# EAGLE design BRD1001-001-001-320 - Counting Registers (EAGLE 9.4.2)
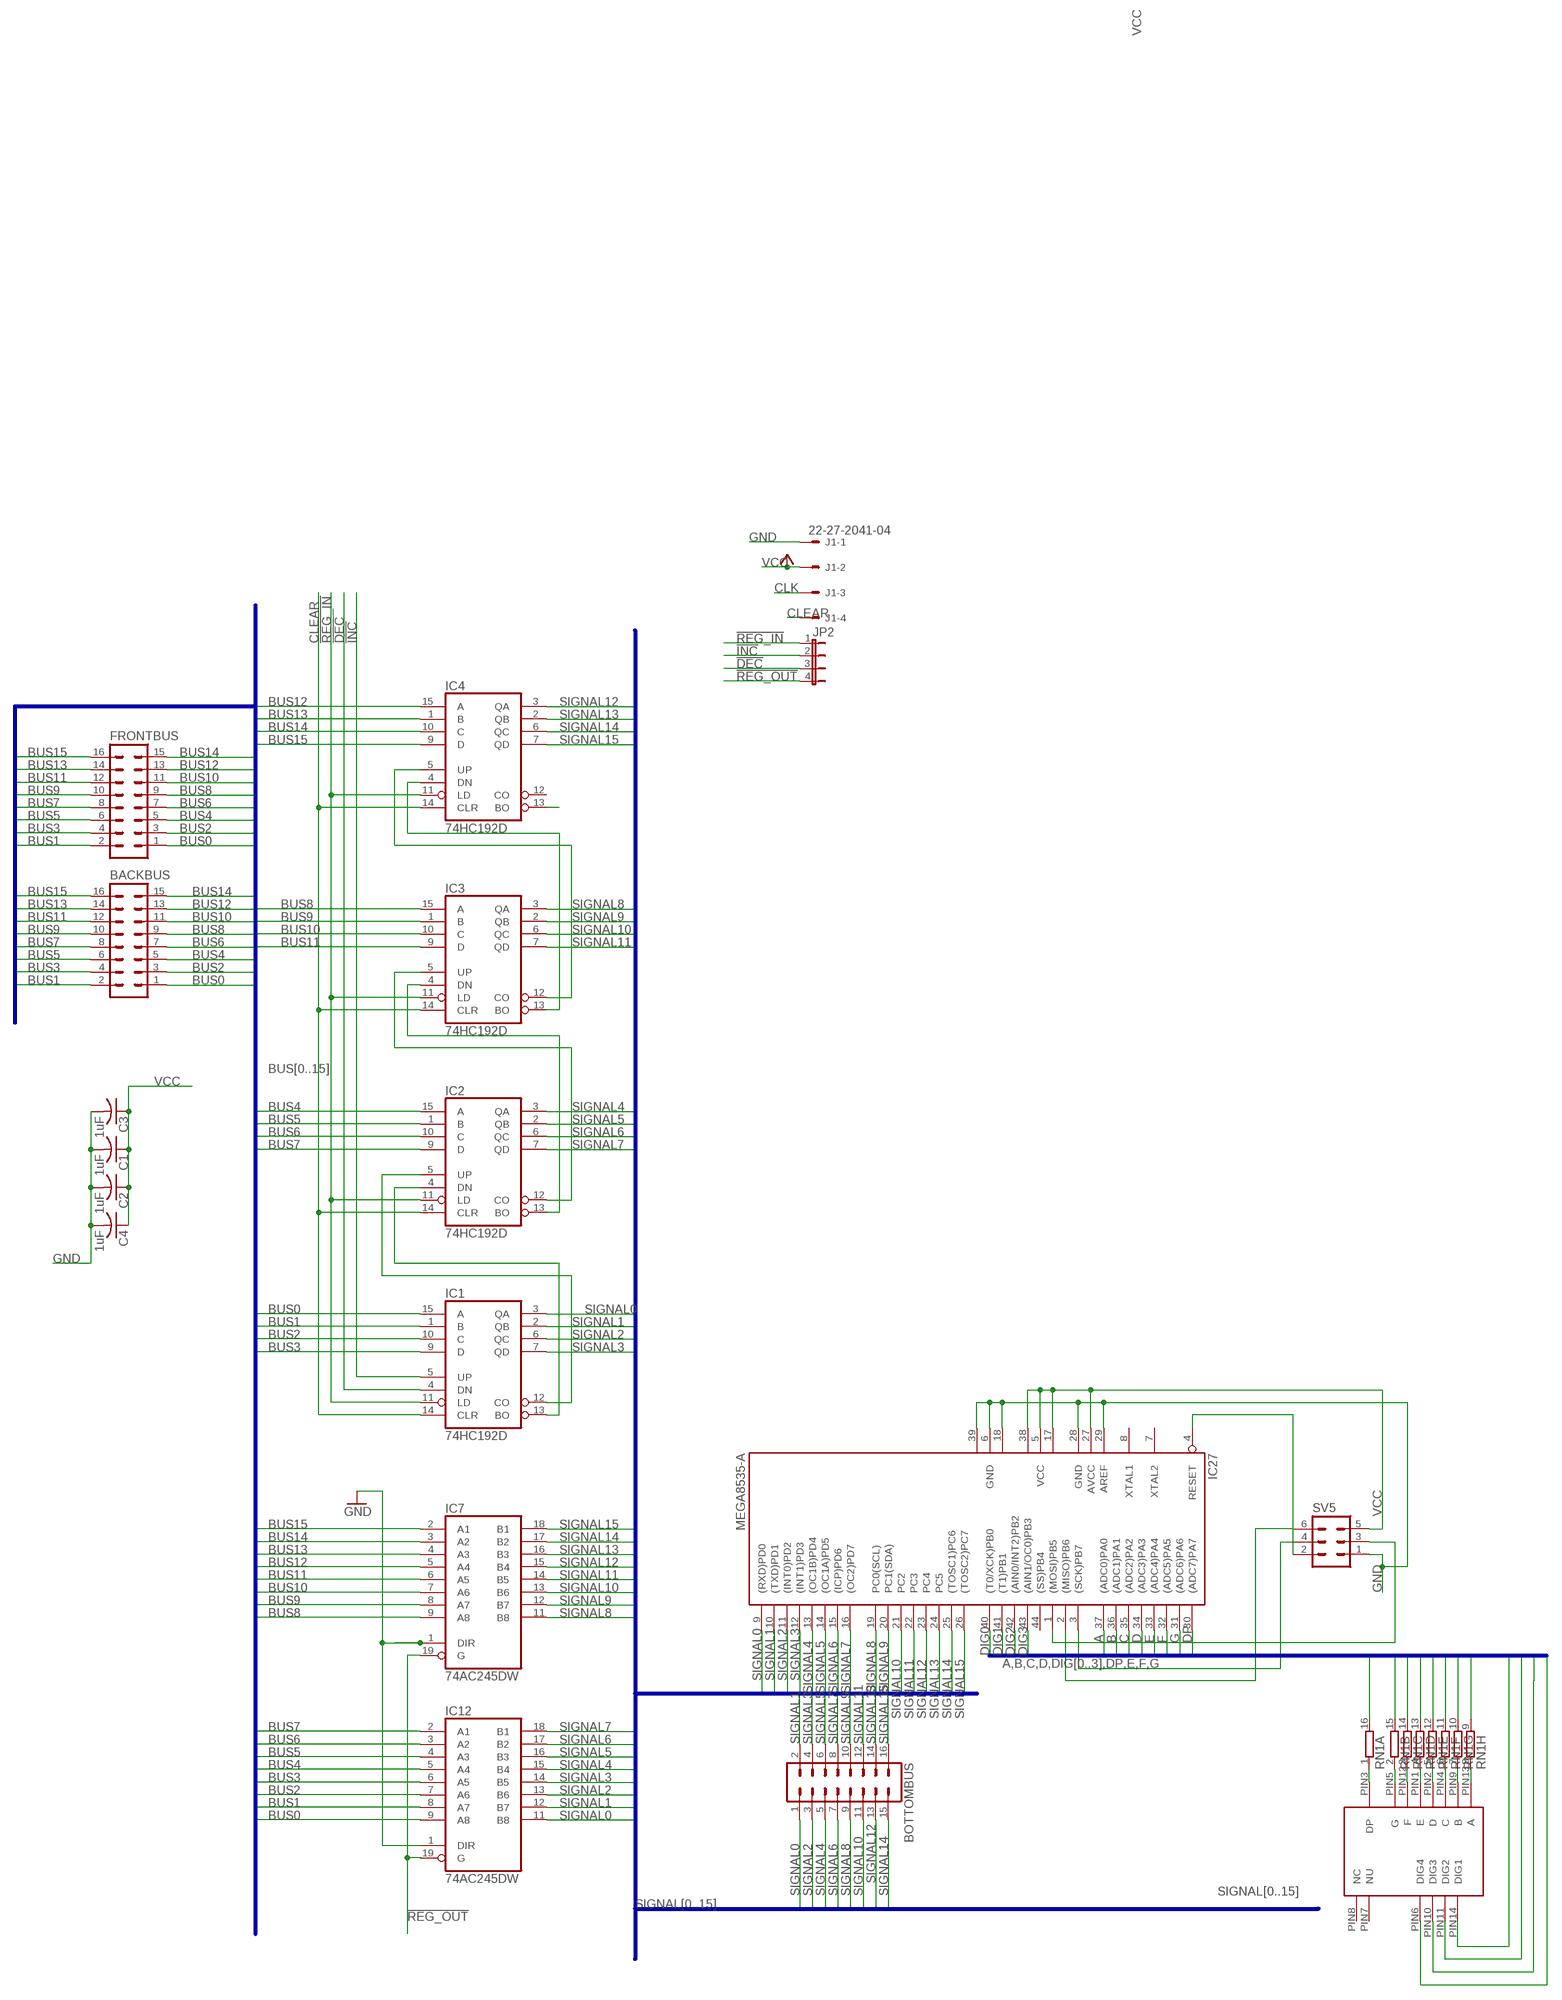
[diagram p0: schematic, sheet 1]

## Parts
BACKBUS  ML16  [ML16]
BOTTOMBUS  ML16  [ML16]
C1  1uF  C-USC1206  [C1206]
C2  1uF  C-USC1206  [C1206]
C3  1uF  C-USC1206  [C1206]
C4  1uF  C-USC1206  [C1206]
FRONTBUS  ML16  [ML16]
IC1  74HC192D  [SO16]
IC2  74HC192D  [SO16]
IC3  74HC192D  [SO16]
IC4  74HC192D  [SO16]
IC7  74AC245DW  [SO20W]
IC12  74AC245DW  [SO20W]
IC27  MEGA8535-A  [TQFP44]
J1  22-27-2041-04  [6410-04]
JP2  JP4E  [JP4]
RN1  8R-NSOMC  [SOMC16]
SV5  ML6  [ML6]
U$1  4-DIGIT-7-SEGMENT  [4-DIGIT-7-SEGMENT]

## Nets
!DEC: IC1.4(DN) JP2.3
!INC: IC1.5(UP) JP2.2
!REG_IN: IC1.11(LD) IC2.11(LD) IC3.11(LD) IC4.11(LD) JP2.1
!REG_OUT: IC7.19(G) IC12.19(G) JP2.4
A: IC27.37((ADC0)PA0) RN1.9
B: IC27.36((ADC1)PA1) RN1.10
BUS0: BACKBUS.1 FRONTBUS.1 IC1.15(A) IC12.9(A8)
BUS1: BACKBUS.2 FRONTBUS.2 IC1.1(B) IC12.8(A7)
BUS2: BACKBUS.3 FRONTBUS.3 IC1.10(C) IC12.7(A6)
BUS3: BACKBUS.4 FRONTBUS.4 IC1.9(D) IC12.6(A5)
BUS4: BACKBUS.5 FRONTBUS.5 IC2.15(A) IC12.5(A4)
BUS5: BACKBUS.6 FRONTBUS.6 IC2.1(B) IC12.4(A3)
BUS6: BACKBUS.7 FRONTBUS.7 IC2.10(C) IC12.3(A2)
BUS7: BACKBUS.8 FRONTBUS.8 IC2.9(D) IC12.2(A1)
BUS8: BACKBUS.9 FRONTBUS.9 IC3.15(A) IC7.9(A8)
BUS9: BACKBUS.10 FRONTBUS.10 IC3.1(B) IC7.8(A7)
BUS10: BACKBUS.11 FRONTBUS.11 IC3.10(C) IC7.7(A6)
BUS11: BACKBUS.12 FRONTBUS.12 IC3.9(D) IC7.6(A5)
BUS12: BACKBUS.13 FRONTBUS.13 IC4.15(A) IC7.5(A4)
BUS13: BACKBUS.14 FRONTBUS.14 IC4.1(B) IC7.4(A3)
BUS14: BACKBUS.15 FRONTBUS.15 IC4.10(C) IC7.3(A2)
BUS15: BACKBUS.16 FRONTBUS.16 IC4.9(D) IC7.2(A1)
C: IC27.35((ADC2)PA2) RN1.11
CLEAR: IC1.14(CLR) IC2.14(CLR) IC3.14(CLR) IC4.14(CLR) J1.4
CLK: J1.3
D: IC27.34((ADC3)PA3) RN1.12
DIG0: IC27.40((T0/XCK)PB0) U$1.PIN14(DIG1)
DIG1: IC27.41((T1)PB1) U$1.PIN11(DIG2)
DIG2: IC27.42((AIN0/INT2)PB2) U$1.PIN10(DIG3)
DIG3: IC27.43((AIN1/OC0)PB3) U$1.PIN6(DIG4)
DP: IC27.30((ADC7)PA7) RN1.16
E: IC27.33((ADC4)PA4) RN1.13
F: IC27.32((ADC5)PA5) RN1.14
G: IC27.31((ADC6)PA6) RN1.15
GND [power]: C1.2 C2.2 C3.2 C4.2 IC7.1(DIR) IC12.1(DIR) IC27.6(GND) IC27.18(GND1) IC27.28(GND) IC27.29(AREF) IC27.39(GND2) J1.1 SV5.1
N$1: IC4.13(BO)
N$2: IC1.12(CO) IC2.5(UP)
N$3: IC1.13(BO) IC2.4(DN)
N$4: IC2.12(CO) IC3.5(UP)
N$5: IC2.13(BO) IC3.4(DN)
N$6: IC3.12(CO) IC4.5(UP)
N$7: IC3.13(BO) IC4.4(DN)
N$18: IC27.1((MOSI)PB5) SV5.3
N$19: IC27.3((SCK)PB7) SV5.4
N$20: IC27.2((MISO)PB6) SV5.6
N$21: IC27.4(RESET) SV5.2
N$24: RN1.8 U$1.PIN13(A)
N$25: RN1.7 U$1.PIN9(B)
N$26: RN1.6 U$1.PIN4(C)
N$27: RN1.5 U$1.PIN2(D)
N$28: RN1.4 U$1.PIN1(E)
N$29: RN1.3 U$1.PIN12(F)
N$30: RN1.2 U$1.PIN5(G)
N$31: RN1.1 U$1.PIN3(DP)
SIGNAL0: BOTTOMBUS.1 IC1.3(QA) IC12.11(B8) IC27.9((RXD)PD0)
SIGNAL1: BOTTOMBUS.2 IC1.2(QB) IC12.12(B7) IC27.10((TXD)PD1)
SIGNAL2: BOTTOMBUS.3 IC1.6(QC) IC12.13(B6) IC27.11((INT0)PD2)
SIGNAL3: BOTTOMBUS.4 IC1.7(QD) IC12.14(B5) IC27.12((INT1)PD3)
SIGNAL4: BOTTOMBUS.5 IC2.3(QA) IC12.15(B4) IC27.13((OC1B)PD4)
SIGNAL5: BOTTOMBUS.6 IC2.2(QB) IC12.16(B3) IC27.14((OC1A)PD5)
SIGNAL6: BOTTOMBUS.7 IC2.6(QC) IC12.17(B2) IC27.15((ICP)PD6)
SIGNAL7: BOTTOMBUS.8 IC2.7(QD) IC12.18(B1) IC27.16((OC2)PD7)
SIGNAL8: BOTTOMBUS.9 IC3.3(QA) IC7.11(B8) IC27.19(PC0(SCL))
SIGNAL9: BOTTOMBUS.10 IC3.2(QB) IC7.12(B7) IC27.20(PC1(SDA))
SIGNAL10: BOTTOMBUS.11 IC3.6(QC) IC7.13(B6) IC27.21(PC2)
SIGNAL11: BOTTOMBUS.12 IC3.7(QD) IC7.14(B5) IC27.22(PC3)
SIGNAL12: BOTTOMBUS.13 IC4.3(QA) IC7.15(B4) IC27.23(PC4)
SIGNAL13: BOTTOMBUS.14 IC4.2(QB) IC7.16(B3) IC27.24(PC5)
SIGNAL14: BOTTOMBUS.15 IC4.6(QC) IC7.17(B2) IC27.25((TOSC1)PC6)
SIGNAL15: BOTTOMBUS.16 IC4.7(QD) IC7.18(B1) IC27.26((TOSC2)PC7)
VCC [power]: C1.1 C2.1 C3.1 C4.1 IC27.5(VCC) IC27.17(VCC1) IC27.27(AVCC) IC27.38(VCC2) J1.2 SV5.5
Unconnected: IC4.12(CO) IC27.7(XTAL2) IC27.8(XTAL1) IC27.44((SS)PB4) U$1.PIN7(NU) U$1.PIN8(NC)

## Buses
BUS[0..15]
SIGNAL[0..15]
A,B,C,D,DIG[0..3],DP,E,F,G

## Power pins joined to a net without a drawn wire
GND: IC1.8(GND) IC2.8(GND) IC3.8(GND) IC4.8(GND) IC7.10(GND) IC12.10(GND)
VCC: IC1.16(VCC) IC2.16(VCC) IC3.16(VCC) IC4.16(VCC) IC7.20(VCC) IC12.20(VCC)

## Library data of the parts
BACKBUS BOTTOMBUS FRONTBUS = con-harting-ml:ML16: HARTING; OC_FARNELL: unknown; OC_NEWARK: unknown
C1-C4 = rcl:C-US: CAPACITOR, American symbol; SPICEPREFIX: C
IC1-IC4 = 74xx-eu:74*192: Synchronous 4-bit UP/DOWN COUNTER
IC7 IC12 = 74xx-eu:74*245: Octal BUS TRANSCEIVER, 3-state
IC27 = atmel:MEGA8535: MICROCONTROLLER 8 Kbytes FLASH 512 bytes SRAM 512 bytes EEPROM USART 8-channel 10 bit ADC Source: avr.lbr; MPN: ATMEGA8535-16AU; OC_FARNELL: 1528437; OC_NEWARK: 01M6908
J1 = con-molex:22-?-04: CONNECTOR wire to board 2.54 mm (.1 inch) pitch header; MF: MOLEX; OC_FARNELL: unknown; OC_NEWARK: unknown
JP2 = jumper:JP4E: JUMPER
RN1 = resistor-dil:8R-N: DIL RESISTOR; OC_FARNELL: unknown; OC_NEWARK: unknown
SV5 = con-harting-ml:ML6: HARTING; OC_FARNELL: unknown; OC_NEWARK: unknown
U$1 = ADAFRUIT:4-DIGIT-7-SEGMENT

## Net classes
1 power: width 0.457 mm

## Board
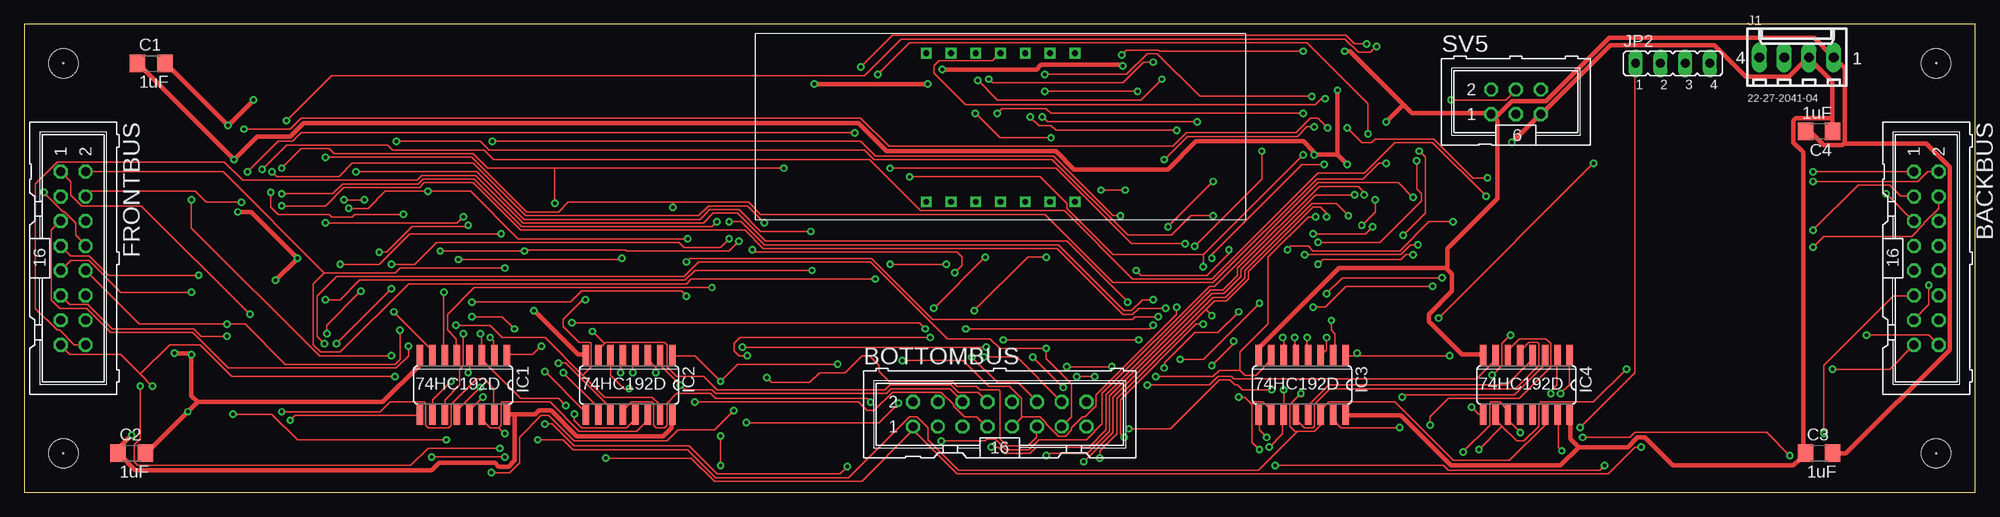
[diagram p1: board, top side]
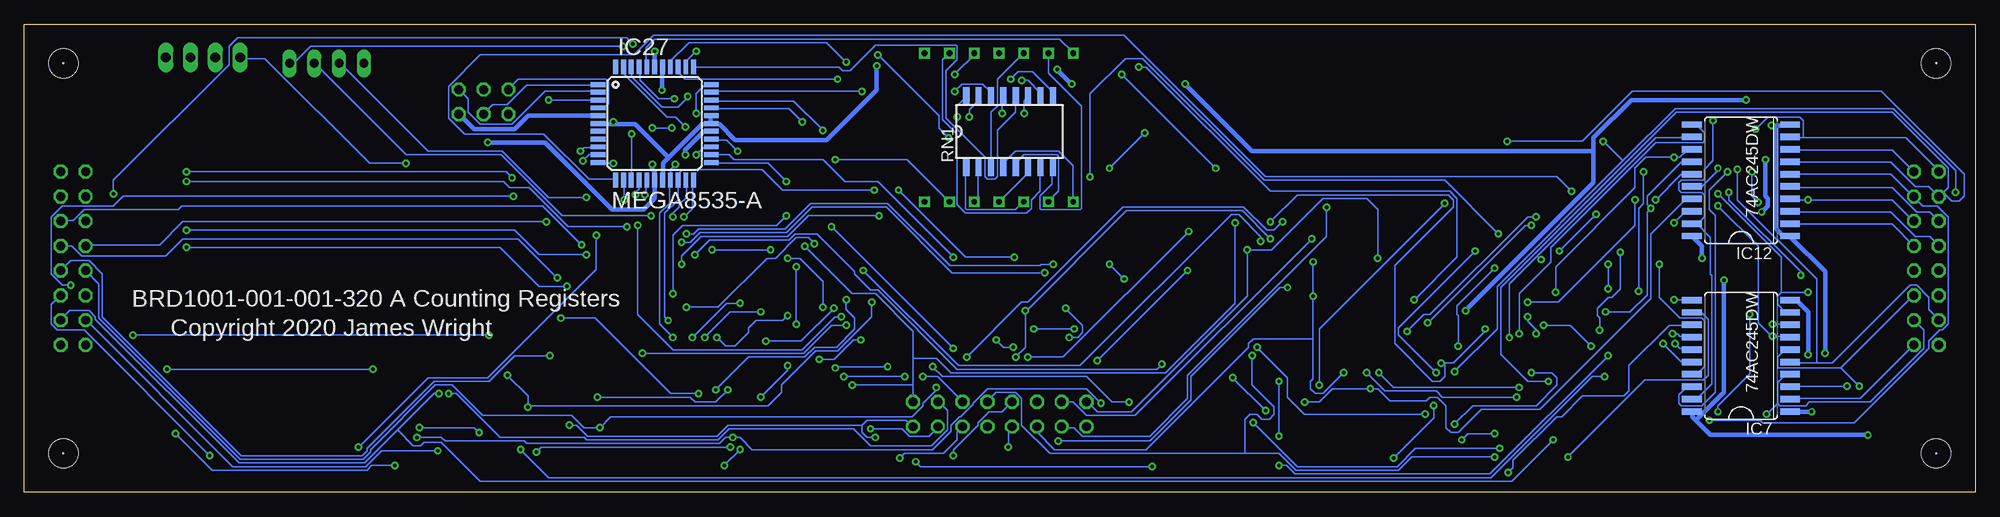
[diagram p2: board, bottom side, seen from below]

Size 200 x 48 mm. Coordinates in mm from the lower left corner, seen from the top.
Outline: 0,0 200,0 200,48 0,48 0,0
Copper layers (1*16): Top 0.035mm / dielectric 1.5mm / Bottom 0.035mm
Design rules "default *": minimum track width 6mil, minimum drill 0.35mm, track to track 6mil, track to pad 6mil, pad to pad 6mil, via to via 6mil, smd to smd 6mil, copper to edge 40mil, drill to drill 6mil, minimum pad ring 10mil, minimum via ring 8mil, stop-mask expansion 4mil, vias tented up to drill 0mil, thermal gap 10mil
Holes 0.12 mm at 4,4 196,44 4,44 196,4
Holes 3 mm at 4,44 4,4 196,4 196,44

### Footprints (pad centres in the part's own frame; a part is rotated, then mirrored left to right if it is on the bottom)
ML16 = drill 0.914 octagon: 1 -8.89,-1.27; 2 -8.89,1.27; 3 -6.35,-1.27; 4 -6.35,1.27; 5 -3.81,-1.27; 6 -3.81,1.27; 7 -1.27,-1.27; 8 -1.27,1.27; 9 1.27,-1.27; 10 1.27,1.27; 11 3.81,-1.27; 12 3.81,1.27; 13 6.35,-1.27; 14 6.35,1.27; 15 8.89,-1.27; 16 8.89,1.27
C1206 = smd 1.6 x 1.8: 1 -1.4,0; 2 1.4,0
SO16 = smd 0.66 x 2.032: 1 -4.445,-3.073; 2 -3.175,-3.073; 3 -1.905,-3.073; 4 -0.635,-3.073; 5 0.635,-3.073; 6 1.905,-3.073; 7 3.175,-3.073; 8 4.445,-3.073; 9 4.445,3.073; 10 3.175,3.073; 11 1.905,3.073; 12 0.635,3.073; 13 -0.635,3.073; 14 -1.905,3.073; 15 -3.175,3.073; 16 -4.445,3.073
SO20W = smd 0.66 x 2.032: 1 -5.715,-5.029; 2 -4.445,-5.029; 3 -3.175,-5.029; 4 -1.905,-5.029; 5 -0.635,-5.029; 6 0.635,-5.029; 7 1.905,-5.029; 8 3.175,-5.029; 9 4.445,-5.029; 10 5.715,-5.029; 11 5.715,5.029; 12 4.445,5.029; 13 3.175,5.029; 14 1.905,5.029; 15 0.635,5.029; 16 -0.635,5.029; 17 -1.905,5.029; 18 -3.175,5.029; 19 -4.445,5.029; 20 -5.715,5.029
TQFP44 = smd 1.5 x 0.5: 1 -5.8,4; 2 -5.8,3.2; 3 -5.8,2.4; 4 -5.8,1.6; 5 -5.8,0.8; 6 -5.8,0; 7 -5.8,-0.8; 8 -5.8,-1.6; 9 -5.8,-2.4; 10 -5.8,-3.2; 11 -5.8,-4; 23 5.8,-4; 24 5.8,-3.2; 25 5.8,-2.4; 26 5.8,-1.6; 27 5.8,-0.8; 28 5.8,0; 29 5.8,0.8; 30 5.8,1.6; 31 5.8,2.4; 32 5.8,3.2; 33 5.8,4 | smd 0.5 x 1.5: 12 -4,-5.8; 13 -3.2,-5.8; 14 -2.4,-5.8; 15 -1.6,-5.8; 16 -0.8,-5.8; 17 0,-5.8; 18 0.8,-5.8; 19 1.6,-5.8; 20 2.4,-5.8; 21 3.2,-5.8; 22 4,-5.8; 34 4,5.8; 35 3.2,5.8; 36 2.4,5.8; 37 1.6,5.8; 38 0.8,5.8; 39 0,5.8; 40 -0.8,5.8; 41 -1.6,5.8; 42 -2.4,5.8; 43 -3.2,5.8; 44 -4,5.8
6410-04 = drill 1.016 long: 1 3.81,0; 2 1.27,0; 3 -1.27,0; 4 -3.81,0
JP4 = drill 0.914 long: 1 -3.81,0; 2 -1.27,0; 3 1.27,0; 4 3.81,0
SOMC16 = smd 1.91 x 0.64: 1 -3.62,4.445; 2 -3.62,3.175; 3 -3.62,1.905; 4 -3.62,0.635; 5 -3.62,-0.635; 6 -3.62,-1.905; 7 -3.62,-3.175; 8 -3.62,-4.445; 9 3.62,-4.445; 10 3.62,-3.175; 11 3.62,-1.905; 12 3.62,-0.635; 13 3.62,0.635; 14 3.62,1.905; 15 3.62,3.175; 16 3.62,4.445
ML6 = drill 0.914 octagon: 1 -2.54,-1.27; 2 -2.54,1.27; 3 0,-1.27; 4 0,1.27; 5 2.54,-1.27; 6 2.54,1.27
4-DIGIT-7-SEGMENT = drill 0.6 square: PIN1 17.48,1.88; PIN2 20.02,1.88; PIN3 22.56,1.88; PIN4 25.1,1.88; PIN5 27.64,1.88; PIN6 30.18,1.88; PIN7 32.72,1.88; PIN8 32.72,17.12; PIN9 30.18,17.12; PIN10 27.64,17.12; PIN11 25.1,17.12; PIN12 22.56,17.12; PIN13 20.02,17.12; PIN14 17.48,17.12

### Placement (x,y rotation side)
BACKBUS  195,24 270 top
BOTTOMBUS  100,8 0 top
C1  13,44 0 top
C2  11,4 0 top
C3  184,4 0 top
C4  184,37 180 top
FRONTBUS  5,24 270 top
IC1  45,11 180 top
IC2  62,11 180 top
IC3  131,11 180 top
IC4  154,11 180 top
IC7  24,14 90 bottom
IC12  24,32 90 bottom
IC27  135.38,37.83 0 bottom
J1  181.7,44.61 0 top
JP2  169,44 0 top
RN1  99,37 90 bottom
SV5  152.92,40.05 0 top
U$1  74.98,27.92 0 top

### Tracks (layer width: path | path; a pad name or v marks a point on that pad's centre or on a via)
!DEC  (via drill 0.35)
  Top 0.152: v45.5,12.25 45.62,12.38 45.62,14 IC1.4 | v53.38,7 54.12,7 56.38,4.75 68.12,4.75 71,1.88 83.62,1.88 v84.38,2.62 | v108.62,3.12 111.62,6.12 111.62,9.75 121.88,20 123.12,20 125.12,22 125.12,22.75 132,29.62 134.5,29.62 v135.75,28.38
  Bottom 0.152: v45.5,12.25 43.38,12.25 42.88,11.75 42.88,11 45,8.88 51.5,8.88 v53.38,7 | v84.38,2.62 108.12,2.62 v108.62,3.12 | v135.75,28.38 144.88,28.38 151.12,34.62 160.88,34.62 170.25,44 JP2.3
!INC  (via drill 0.35)
  Top 0.152: v70.5,21 46.12,21 43.38,18.25 43.38,16.62 44.25,15.75 44.25,14.12 IC1.5 | v94,5.25 98.5,5.25 98.75,5.5 99.5,5.5 100.62,4.38 103,4.38 104,5.38 108.88,5.38 110.5,7 110.5,10.12 121.5,21.12 122,21.12 132.62,31.75 140.88,31.75 v142.38,30.25
  Bottom 0.152: v70.5,21 71.25,21 80.38,11.88 80.38,9.5 84.62,5.25 v94,5.25 | v142.38,30.25 146.25,30.25 151,35 158.62,35 167.62,44 JP2.2
!REG_IN  (via drill 0.35)
  Top 0.152: v45,16.25 45,13 44.62,12.62 44.62,11 43.12,9.5 43.12,8 IC1.11 | v45.88,18 49,18 v50.25,16.75 | v54.75,13.25 55.5,13.25 60,8.75 60,8 IC2.11 | v127.62,4.62 129,6 129,7.88 IC3.11 129.12,8 v129.12,10.5 | v147.5,4.12 150.25,6.88 150.25,9.12 150.38,9.25 151.25,9.25 152,8.5 152,8 IC4.11 152.12,7.88 152.12,7.38 v153.38,6.12 | v159.5,6.62 165.12,12.25 165.12,44 JP2.1 | v72.25,27.75 73.5,27.75 75.88,25.38 106,25.38 112.75,18.62 113.5,18.62 114.62,19.75 v115.75,19.75
  Bottom 0.152: v45,16.25 45,16.62 45.88,17.5 v45.88,18 | v50.25,16.75 50.25,16.5 53.5,13.25 54.38,13.25 | v127.62,4.62 147,4.62 v147.5,4.12 | v159.5,6.62 153.88,6.62 v153.38,6.12 | 54.38,13.25 54.38,11.88 54.88,11.38 55.62,11.38 59.5,15.25 59.5,23.25 53.5,29.25 53.5,30 54,30.5 69.5,30.5 v72.25,27.75 | v115.75,19.75 115.75,18.75 114.88,17.88 114.88,16.75 116.75,14.88 119,14.88 120,13.88 125.75,13.88 v129.12,10.5 | 54.38,13.25 v54.75,13.25
!REG_OUT  (via drill 0.35)
  Top 0.152: v138.62,45.75 138,45.12 136.75,45.12 135.38,46.5 89.88,46.5 86.12,42.75 31.5,42.75 v26.88,38.12
  Bottom 0.152: 28.5,27.5 27.12,26.12 27.12,22.38 27,22.25 27,11.12 28.5,9.62 29,9.62 IC7.19 | 28.5,27.5 29,27.5 IC12.19 28.5,27.5 | JP2.4 172.38,44 170.62,45.75 v138.62,45.75 | v26.88,38.12 26.88,34 27.75,33.12 27.75,32.12 27.88,32 30.12,32 30.38,31.75 30.38,31 30.12,30.75 28,30.75 27.75,30.5 27.75,28.25 28.5,27.5
A  (via drill 0.35)
  Top 0.152: v115.75,44.12 114.75,44.12 112.62,42 99.25,42 v98.88,42.38
  Bottom 0.152: v115.75,44.12 117.75,46.12 131.88,46.12 133.75,44.25 133.75,43.75 IC27.37 | v98.88,42.38 98.12,43.12 96.62,43.12 94.62,41.12 94.62,40.62 RN1.9
B  (via drill 0.35)
  Top 0.152: v116.62,42.38 114.5,40.25 99.75,40.25 v97.75,42.25
  Bottom 0.152: v116.62,42.38 132.25,42.38 132.88,43 132.88,43.62 IC27.36 | v97.75,42.25 97.12,42.25 95.88,41 95.88,40.62 RN1.10
BUS0  (via drill 0.35)
  Top 0.152: v26.38,8.25 36.5,8.25 37.5,9.25 41,9.25 41.12,9.12 41.12,6.88 41.38,6.62 43.5,6.62 43.75,6.88 43.75,9 46.38,11.62 47.12,11.62 48.12,10.62 48.12,8 IC1.15 | v23.12,18.25 12,29.38 5.88,29.38 4.75,30.5 4.75,31.88 3.75,32.88 FRONTBUS.1 | v183.38,32.88 193.62,32.88 BACKBUS.1 | v150,32.25 148.5,32.25 144.5,36.25 138.5,36.25 138.12,35.88 137.12,35.88 v135.62,37.38 | v133.62,37.38 132.62,38.38 131.88,38.38 130.38,36.88 119.12,36.88 117.75,35.5 88.62,35.5 85.75,38.38 28.38,38.38 27.25,37.25 v22.5,37.25
  Bottom 0.152: 17.62,36.38 7.12,36.38 3.75,33 FRONTBUS.1 | 17.62,36.38 18.88,36.38 IC12.9 | v26.38,8.25 26.38,8.88 23.12,12.12 v23.12,18.25 | v183.38,32.88 150.62,32.88 v150,32.25 | v133.62,37.38 v135.62,37.38 | v22.5,37.25 21.25,38.5 18,38.5 17.62,38.12 17.62,36.38
BUS1  (via drill 0.35)
  Top 0.152: v53,15 52.12,14.12 49.5,14.12 IC1.1 | v49.25,23 38.5,23 38,22.5 30.75,22.5 | 30.75,22.5 20.38,32.88 6.38,32.88 FRONTBUS.2 | v183.38,31.88 194.12,31.88 195.12,32.88 196.25,32.88 BACKBUS.2 | v138.25,27.25 137.5,26.5 v132.12,26.5 | v88.75,23.38 v94.5,23.38 | v87.25,21.88 68.38,21.88 67.88,21.38 39.38,21.38 32.38,14.38 30.38,14.38 29.62,15.12 29.62,21.38 30.75,22.5
  Bottom 0.152: IC12.8 18.88,35.12 8.5,35.12 6.38,33 FRONTBUS.2 | v53,15 53,18.12 53.12,18.25 53.12,19.12 v49.25,23 | v183.38,31.88 150.88,31.88 150.25,31.25 148.25,31.25 144.25,27.25 v138.25,27.25 | v132.12,26.5 131.38,26.5 130.88,27 122,27 119.38,29.62 111.5,29.62 105.12,23.25 95.88,23.25 95.75,23.38 v94.5,23.38 | v87.25,21.88 v88.75,23.38
BUS2  (via drill 0.35)
  Top 0.152: v43.75,11.38 41.88,9.5 41.88,8 IC1.10 | v183.38,26.88 188,31.5 191.25,31.5 192.38,30.38 193.62,30.38 BACKBUS.3 | v142.38,24.38 141.62,24.38 141.12,23.88 133.12,23.88 v132.62,23.38 | v112.38,28.38 111.62,28.38 105.5,34.5 87.25,34.5 85.75,36 v48,36
  Bottom 0.152: v43.75,11.38 45.88,11.38 48.62,14.12 48.62,21 30.62,39 8.5,39 2.75,33.25 2.75,31.25 3.25,30.75 | 3.25,30.75 3.62,30.38 FRONTBUS.3 | IC12.7 18.88,33.88 8.62,33.88 6.12,31.38 4.75,31.38 3.75,30.38 FRONTBUS.3 | v183.38,26.88 149.75,26.88 147.25,24.38 v142.38,24.38 | v132.62,23.38 132.62,24.25 130.62,26.25 121.75,26.25 119.62,28.38 v112.38,28.38 | v48,36 40.25,36 35.12,41.12 9.62,41.12 1.12,32.62 1.12,30.38 1.62,29.88 2.38,29.88 3.25,30.75 | 3.25,30.75 FRONTBUS.3
BUS3  (via drill 0.35)
  Top 0.152: v27.25,7.38 27.75,7.88 40.5,7.88 IC1.9 | v183.38,25.12 184.5,26.25 193.5,26.25 194.75,27.5 194.75,27.62 196.25,29.12 196.25,30.25 BACKBUS.4 | v144.38,21.12 135.5,21.12 133.38,19 v132.12,19 | v119,25.5 113.5,25.5 105.75,33.25 v88.75,33.25 | v85.12,36.88 28.38,36.88 27.5,36 26,36 v22.88,32.88 | v22.25,29.75 18.62,29.75 17.5,30.88 6.88,30.88 6.38,30.38 FRONTBUS.4
  Bottom 0.152: v27.25,7.38 22,7.38 21.75,7.12 12.38,7.12 4.75,14.75 4.75,15.5 3.62,16.62 3.38,16.62 2.75,17.25 2.75,28.25 3.88,29.38 5.38,29.38 6.25,30.25 FRONTBUS.4 6.38,30.38 8.62,32.62 18.88,32.62 IC12.6 | v183.38,25.12 151.25,25.12 147.25,21.12 v144.38,21.12 | v132.12,19 128.88,19 123.88,24 123,24 120.88,26.12 119.62,26.12 v119,25.5 | v85.12,36.88 v88.75,33.25 | v22.88,32.88 22.88,30.38 v22.25,29.75
BUS4  (via drill 0.35)
  Top 0.152: 57.25,12 53.38,15.88 49,15.88 47.75,17.12 v44.25,17.12 | 57.25,12 59.5,9.75 64.38,9.75 65.12,9 65.12,8 IC2.15 | v39.38,15 39.38,14 38.12,12.75 20.88,12.75 17.25,16.38 8.88,16.38 6.38,18.88 3.62,18.88 2.75,19.75 2.75,26.88 3.62,27.75 FRONTBUS.5 | v190.88,30.62 193.62,27.88 BACKBUS.5 | v137.62,46 136.38,46 135.5,46.88 89,46.88 v85.75,43.62 | v57.5,19.75 57.25,19.75 55.25,17.75 55.25,17 56.88,15.38 58,15.38 58.12,15.25 58.12,12.88 57.25,12
  Bottom 0.152: IC12.5 18.88,31.25 8.5,31.25 6,28.75 4.62,28.75 3.75,27.88 FRONTBUS.5 | v44.25,17.12 41.5,17.12 v39.38,15 | v190.88,30.62 190.88,32 179,43.88 179,45.75 178.12,46.62 138.25,46.62 v137.62,46 | v85.75,43.62 85,43.62 72.25,30.88 53.88,30.88 53.12,30.12 53.12,24.12 v57.5,19.75
BUS5  (via drill 0.35)
  Top 0.152: v71.38,2.75 v71.38,5.75 | v37.62,14 30.25,14 17.12,27.12 v17.12,30 | IC2.1 66.5,14 68.75,14 v71.38,11.38 73.12,13.12 v83.38,13.12 | v142.88,25.38 142.12,25.38 141.12,24.38 v131.25,24.38
  Bottom 0.152: IC12.4 18.88,30 v17.12,30 8.5,30 6.38,27.88 FRONTBUS.6 | v71.38,5.75 v71.38,11.38 | v71.38,2.75 70.62,2.75 69.75,1.88 49.75,1.88 v37.62,14 | v142.88,25.38 146.88,29.38 183.88,29.38 184.25,29 193.88,29 195,27.88 196.25,27.88 BACKBUS.6 | v131.25,24.38 129.75,25.88 121.62,25.88 121,26.5 118.75,26.5 114.88,22.62 114.88,22.38 113.25,20.75 112.5,20.75 104.38,12.62 83.88,12.62 v83.38,13.12
BUS6  (via drill 0.35)
  Top 0.152: v55.25,12.25 58.75,8.75 58.75,8 IC2.10 | v42.62,24.75 v51.25,24.75 51.38,24.88 61.62,24.88 61.75,24.75 72.25,24.75 v73.25,25.75 | v38.88,28.5 33.88,28.5 33.62,28.25 31.5,28.25 31.25,28.5 26,28.5 25.25,29.25 v25.25,30.75 | v17.88,22.25 8.62,22.25 6.62,24.25 4.75,24.25 FRONTBUS.7 | v146.5,27.75 144,27.75 141,24.75 132.12,24.75 131.62,25.25 129.88,25.25 v129.5,24.88 | v123.5,24.88 123.5,24.5 121.25,22.25 114.5,22.25 v114,22.75
  Bottom 0.152: v55.25,12.25 59.12,16.12 59.12,16.88 v51.25,24.75 | v38.88,28.5 v42.62,24.75 | v25.25,30.75 25.25,30 17.88,22.62 v17.88,22.25 | IC12.3 18.88,28.75 8.62,28.75 6.12,26.25 4.62,26.25 3.75,25.38 FRONTBUS.7 | v146.5,27.75 183.75,27.75 186.12,25.38 193.62,25.38 BACKBUS.7 | v123.5,24.88 v129.5,24.88 | v114,22.75 104.25,13 91.75,13 76.25,28.5 75.5,28.5 73.25,26.25 v73.25,25.75
BUS7  (via drill 0.35)
  Top 0.152: v53.38,12.38 57.5,8.25 57.5,8 IC2.9 | v2,30.75 4,28.75 4.12,28.75 5.25,27.62 5.25,26.38 6.25,25.38 FRONTBUS.8 | v145.38,22 135.12,22 v133.5,20.38 | v121.88,28.38 119.62,28.38 117.62,26.38 113.12,26.38 105.38,34.12 87.12,34.12 86.12,35.12 47.62,35.12 46.75,36 v38.12,36
  Bottom 0.152: FRONTBUS.8 8.5,27.5 18.88,27.5 IC12.2 | v53.38,12.38 49,16.75 49,21.12 36.12,34 | 36.12,34 30.75,39.38 8.38,39.38 2,33 v2,30.75 | v145.38,22 149.38,26 183.75,26 185.5,24.25 194.12,24.25 195.12,25.25 196.25,25.25 BACKBUS.8 | v133.5,20.38 133.5,26.38 132.5,27.38 122.88,27.38 v121.88,28.38 | 36.12,34 v38.12,36
BUS8  (via drill 0.35)
  Top 0.152: v17.12,20.5 9.88,20.5 6.62,23.75 4.75,23.75 FRONTBUS.9 | v141,6.62 135,6.62 134.25,7.38 134.25,7.88 IC3.15 | v26.38,30.62 31.62,30.62 32.62,31.62 40.38,31.62 40.88,32.12 46.12,32.12 51,27.25 70.5,27.25 v71,27.75 | v106.5,10.75 v103.38,13.88
  Bottom 0.152: 19.88,20.5 20.25,20.12 20.25,19.25 19.5,18.5 19,18.5 IC7.9 | v17.12,20.5 19.88,20.5 | BACKBUS.9 192.38,21.38 192.38,17.88 177.88,3.38 165.25,3.38 164.5,4.12 164.5,4.38 157.88,11 156.12,11 153,7.88 143.88,7.88 142.62,6.62 v141,6.62 139.88,7.75 109,7.75 107.88,8.88 107.88,9.12 106.5,10.5 v106.5,10.75 | 19.88,20.5 19.88,24.12 v26.38,30.62 | v71,27.75 71.88,26.88 72.62,26.88 75,29.25 87.38,29.25 97.12,19.5 97.75,19.5 v103.38,13.88
BUS9  (via drill 0.35)
  Top 0.152: FRONTBUS.10 11.75,17.25 v20.75,17.25 22.62,17.25 26.75,13.12 38,13.12 38.5,13.62 v38.5,16.62 | v146.12,14 136.62,14 | 136.62,14 135.5,14 IC3.1 | v36.38,24.62 37.12,24.62 39.75,27.25 45.38,27.25 v45.5,27.38 | v56.12,17.38 91.75,17.38 v92.38,16.75 | v96.5,16.75 115.38,16.75 v115.75,17.12 | 136.62,14 v136.62,14.25
  Bottom 0.152: v20.75,17.25 19,17.25 IC7.8 | v146.12,14 149.75,14 152.38,11.38 158,11.38 164.88,4.5 164.88,4.25 165.38,3.75 177.75,3.75 192,18 192,22.38 193.38,23.75 195.25,23.75 BACKBUS.10 | v38.5,16.62 38.5,17.88 38.75,18.12 38.75,18.88 37.62,20 37.25,20 36.38,20.88 v36.38,24.62 | v45.5,27.38 46.12,27.38 v56.12,17.38 | v96.5,16.75 v92.38,16.75 | v115.75,17.12 117.25,17.12 120.12,14.25 v136.62,14.25
BUS10  (via drill 0.35)
  Top 0.152: v20.75,16 18.12,16 17.38,16.75 9,16.75 6.5,19.25 4.62,19.25 3.75,20.12 FRONTBUS.11 | 125.88,9 126.12,9.25 127,9.25 127.75,8.5 127.75,8 IC3.10 | 125.88,9 125.88,5.12 v126.62,4.38 | v128.25,2.75 145.5,2.75 146,2.25 161.5,2.25 v162,2.75 | v184.5,6 184.5,13 191.62,20.12 193.62,20.12 BACKBUS.11 | v26.38,29.38 30.88,29.38 32.75,31.25 40.5,31.25 41,31.75 46,31.75 50.88,26.88 73.88,26.88 75.75,25 105.88,25 112.62,18.25 113.62,18.25 114.25,18.88 v117,18.88 | v124,15.5 124,15.25 v121.75,13 | v124.5,9.75 125.12,9.75 125.88,9
  Bottom 0.152: IC7.7 19,16 v20.75,16 21,16.25 21.12,16.25 22.25,17.38 22.25,25.25 v26.38,29.38 | v128.25,2.75 v126.62,4.38 | v162,2.75 164.38,2.75 164.88,2.25 180.75,2.25 v184.5,6 | v117,18.88 120.38,15.5 v124,15.5 | v121.75,13 121.75,12.5 v124.5,9.75
BUS11  (via drill 0.35)
  Top 0.152: v127.38,5.62 126.62,6.38 126.62,7.88 IC3.9 | v159.75,5.62 164.62,5.62 165.12,6.12 178.62,6.12 v181,3.75 | v11.88,10.88 11.88,5.5 11.25,4.88 11.25,3.12 11.62,2.75 39.62,2.75 41.38,4.5 v48.75,4.5 | v74,7.12 87.62,7.12 v89.62,9.12
  Bottom 0.152: 13.75,12.75 20.12,12.75 20.25,12.88 20.25,13.88 19.5,14.62 19,14.62 IC7.6 | 13.75,12.75 6.38,20.12 FRONTBUS.12 | v159.75,5.62 157.25,5.62 156.88,5.25 148.75,5.25 148.5,5 128.75,5 128.12,5.62 v127.38,5.62 126.62,5.62 125.38,4.38 106.88,4.38 105,6.25 105,6.88 104.12,7.75 104,7.75 102.75,9 102.75,9.12 101.25,10.62 91.12,10.62 v89.62,9.12 | v181,3.75 193.88,16.62 196.62,16.62 197.25,17.25 197.25,19.25 196.38,20.12 BACKBUS.12 | v11.88,10.88 13.75,12.75 | v48.75,4.5 57.38,4.5 59.25,2.62 69.5,2.62 v74,7.12
BUS12  (via drill 0.35)
  Top 0.152: v157.62,4.25 157.25,4.62 157.25,7.88 IC4.15 | v24.38,33.12 26.88,35.62 37.25,35.62 37.75,35.12 47.12,35.12 48.12,34.12 86.62,34.12 91.88,28.88 106.62,28.88 113.62,21.88 121.75,21.88 132.62,32.75 137.38,32.75 140.5,35.88 144.38,35.88 v149.88,30.38 | v195.25,21.25 195.25,19.25 193.75,17.75 BACKBUS.13
  Bottom 0.152: 16.25,13.25 14.62,13.25 6.62,21.25 6,21.25 4.75,20 4.75,18.75 3.75,17.75 FRONTBUS.13 | 16.25,13.25 18.88,13.25 IC7.5 | v157.62,4.25 163.38,4.25 165,2.62 178.62,2.62 193.62,17.62 BACKBUS.13 | 16.25,13.25 16.25,21.88 24.38,30 v24.38,33.12 | v149.88,30.38 189.88,30.38 190.88,29.38 196.12,29.38 197.25,28.25 197.25,22.38 196.12,21.25 v195.25,21.25
BUS13  (via drill 0.35)
  Top 0.152: v157.5,10.12 158.38,11 158.38,14 IC4.1 | v21.38,8 25.38,8 28,5.38 v43.25,5.38
  Bottom 0.152: 20.25,9.12 20.25,11.25 19.5,12 19,12 IC7.4 | 20.25,9.12 20,8.88 17.38,8.88 17,9.25 10.75,9.25 5.25,14.75 5.25,16.62 6.25,17.62 FRONTBUS.14 | v157.5,10.12 158,10.12 161.75,6.38 | 161.75,6.38 165.12,3 178,3 192.75,17.75 192.75,18 193.38,18.62 195.38,18.62 196.25,17.75 BACKBUS.14 | v21.38,8 20.25,9.12 | v43.25,5.38 47.5,1.12 153.25,1.12 157.25,5.12 159,5.12 159.38,4.75 160.12,4.75 161.75,6.38
BUS14  (via drill 0.35)
  Top 0.152: 11.88,12.12 9.88,14.12 4.62,14.12 3.75,15 FRONTBUS.15 | 11.88,12.12 v13.12,10.88 | 151.5,6.75 153,5.25 153.75,5.25 155.25,6.75 155.25,9 155.5,9.25 160.88,9.25 v164.25,12.62 | 151.5,6.75 150.88,7.38 150.88,7.88 IC4.10 | v185.38,12.62 191.25,12.62 193.62,15 BACKBUS.15 | 11.88,12.12 14.88,15.12 18,15.12 21.25,11.88 v38,11.88 | 151.5,6.75 v149.12,4.38
  Bottom 0.152: v13.12,10.88 18.88,10.88 IC7.3 | v185.38,12.62 v164.25,12.62 | v38,11.88 39.25,11.88 49.62,1.5 146.25,1.5 v149.12,4.38
BUS15  (via drill 0.35)
  Top 0.152: v148.38,8.75 149.12,8 149.5,8 IC4.9 | v150.5,12 151.5,13 151.5,15.25 v152.38,16.12 | v188.88,16.12 195.25,16.12 196.25,15.12 BACKBUS.16 | v113.12,19.5 106.88,25.75 76,25.75 73.12,28.62 70.62,28.62 69.62,27.62 51.12,27.62 46.25,32.5 40.75,32.5 40.25,32 22.38,32 20.5,33.88 3.38,33.88 1.12,31.62 1.12,18.88 3.38,16.62 3.62,16.62 5.12,15.12 6.25,15.12 FRONTBUS.16
  Bottom 0.152: IC7.2 18.88,9.62 11.75,9.62 6.38,15 FRONTBUS.16 | 148.38,8.88 148.38,9.88 v150.5,12 | v188.88,16.12 v152.38,16.12 | v113.12,19.5 113.12,18 116.62,14.5 118.88,14.5 122.38,11 122.38,10.25 123.75,8.88 148.38,8.88 | 148.38,8.88 v148.38,8.75
C  (via drill 0.35)
  Top 0.152: v131.12,45.25 116.38,45.25 116.25,45.38 113,45.38 v112.5,44.88 | v105.25,36.38 100,36.38 v97.5,38.88
  Bottom 0.152: v131.12,45.25 132.12,44.25 132.12,43.75 IC27.35 | v112.5,44.88 106.25,38.62 106.25,37.38 v105.25,36.38 | v97.5,38.88 97.5,40.12 97.12,40.5 RN1.11
CLEAR  (via drill 0.35)
  Top 0.152: 48.62,6.62 47.75,6.62 47,7.38 47,7.88 IC1.14 | 48.62,6.62 48.88,6.88 48.88,9.12 49,9.25 53.88,9.25 56.88,6.25 62.75,6.25 63.88,7.38 63.88,7.88 IC2.14 | IC4.14 155.88,7.88 155.88,6.88 152.25,3.25 146.5,3.25 140.5,9.25 133.75,9.25 133,8.5 133,8 IC3.14 132.88,7.88 132.88,6.88 132.25,6.25 130.5,6.25 | v145,17.88 v160.88,33.75 | v130.88,10.12 129.75,9 129.75,6.75 130.25,6.25 130.5,6.25 | v49.25,6 48.62,6.62 | v52.62,5.38 55.25,5.38 56.25,4.38 68,4.38 70.88,1.5 84.5,1.5 90.75,7.75 91.5,7.75 92.62,6.62 92.62,5.38 95.75,2.25 126.5,2.25 130.5,6.25
  Bottom 0.152: v160.88,33.75 164.62,33.75 175.38,44.5 177.88,44.5 J1.4 | v145,17.88 141.5,17.88 133.75,10.12 v130.88,10.12 | v49.25,6 52,6 v52.62,5.38
D
  Bottom 0.152: IC27.34 116.5,43.62 116.12,43.25 115.38,43.25 112.75,45.88 104.5,45.88 104.38,45.75 104.38,44.38 105.5,43.25 105.5,38.38 101.5,34.38 101.5,32.38 101.25,32.12 100.5,32.12 100.25,32.38 100.25,37.12 98.38,39 98.38,40.5 RN1.12
DIG0
  Bottom 0.152: IC27.40 136.25,43.75 136.25,45.62 135.38,46.5 93.88,46.5 92.5,45.12 U$1.PIN14
DIG1  (via drill 0.35)
  Top 0.152: v133.38,40.38 133,40.38 132.38,39.75 96.5,39.75 93.25,43 93.25,43.75 93.75,44.25 99.25,44.25 100,45 U$1.PIN11
  Bottom 0.152: v133.38,40.38 135,40.38 136.88,42.25 136.88,43.62 IC27.41
DIG2  (via drill 0.35)
  Top 0.152: v132,40.62 120.5,40.62 116.12,45 115.12,45 113,42.88 v104.62,42.88
  Bottom 0.152: v132,40.62 132,40.5 133,39.5 134.62,39.5 137.75,42.62 137.75,43.62 IC27.42 | v104.62,42.88 102.5,45 U$1.PIN10
DIG3  (via drill 0.35)
  Top 0.152: v132.25,37.5 131.5,37.5 130.5,36.5 119.25,36.5 v116.88,34.12
  Bottom 0.152: v132.25,37.5 133.25,38.5 134.12,38.5 138.5,42.88 138.5,43.62 IC27.43 | v116.88,34.12 109.5,34.12 105.25,29.88 U$1.PIN6
DP  (via drill 0.35)
  Top 0.152: v120.25,38 104.88,38 v104.38,38.5
  Bottom 0.152: v120.25,38 121.62,39.38 129.5,39.38 IC27.30 | v104.38,38.5 104.38,39.62 103.5,40.5 RN1.16
E  (via drill 0.35)
  Top 0.152: v131.12,38.88 105.25,38.88 104.75,39.38 100.25,39.38 v99.75,38.88
  Bottom 0.152: v131.12,38.88 131.12,40.88 130.25,41.75 129.62,41.75 IC27.33 | v99.75,38.88 99.75,40.5 RN1.13
F  (via drill 0.35)
  Top 0.152: v104.62,41.12 v114.12,41.12
  Bottom 0.152: v114.12,41.12 129.5,41.12 IC27.32 | v104.62,41.12 103.88,41.88 101.75,41.88 101,41.12 101,40.62 RN1.14
G  (via drill 0.35)
  Top 0.152: v118.12,37.12 105.75,37.12 105.25,37.62 104,37.62 v103.12,38.5
  Bottom 0.152: v118.12,37.12 121.12,40.12 129.5,40.12 IC27.31 | v103.12,38.5 103.12,39.25 102.25,40.12 102.25,40.5 RN1.15
GND  (via drill 0.35)
  Top 0.457: C2.2 12.5,4 v16.75,8.25 17.75,9.25 | 17.75,9.25 36.75,9.25 40.5,13 40.5,14 IC1.8 | 17.75,9.25 17.12,9.88 v17.12,14.12 17,14.25 v15.38,14.25 | C1.2 14.5,44 v20.88,37.62 v23.5,40.25 | v52.25,18.62 56.75,14.12 57.5,14.12 IC2.8 | 145.75,23 134.75,23 126.62,14.88 126.62,14.12 IC3.8 | 145.75,23 146.38,22.38 146.38,20.62 144,18.25 144,17.5 147.38,14.12 149.5,14.12 IC4.8 | v135.38,45.25 135.88,45.25 141.38,39.75 | 141.38,39.75 142.25,38.88 150.38,38.88 SV5.1 | 141.38,39.75 v139.62,38 | 145.75,23 145.88,23.12 145.88,25 151,30.12 151,38.12 150.5,38.62 SV5.1 | C4.2 183.12,37 184.5,35.62 186.38,35.62 186.62,35.88 | 186.62,35.88 186.62,43.5 185.62,44.5 J1.1 185.38,44.75 183.5,46.62 162.5,46.62 156,40.12 152.5,40.12 150.88,38.5 SV5.1 | C3.2 186.75,4 197.38,14.62 197.38,33.38 195,35.75 186.75,35.75 186.62,35.88 | v92.62,41.88 v81,41.88 | v94.12,43.38 103.75,43.38 104.25,43.88 112.5,43.88 v112.62,43.75
  Bottom 0.457: v16.75,8.25 18.88,8.25 IC7.1 | v17.12,14.12 17.12,18.5 18.25,19.62 18.88,19.62 IC7.10 | 20.38,37.62 19,37.62 IC12.10 | 20.38,37.62 v20.88,37.62 | v52.25,18.62 39.12,31.75 39.12,35 | 39.12,35 39.12,36.38 35.25,40.25 v23.5,40.25 | 20.38,37.62 20.38,27 19.75,26.38 19,26.38 IC12.1 18.88,26.12 15.38,22.62 v15.38,14.25 | IC27.28 129.62,37.88 129.62,38.62 IC27.29 | 133.94,34.31 130.5,37.75 129.75,37.75 IC27.28 | 133.94,34.31 134.5,33.75 134.5,32.12 IC27.18 | 139.62,37.75 137.38,37.75 133.94,34.31 | 139.62,37.75 141.12,37.75 IC27.6 | v135.38,45.25 135.38,43.75 IC27.39 | v139.62,38 139.62,37.75 | 39.12,35 74.12,35 v81,41.88 | v94.12,43.38 v92.62,41.88 | v112.62,43.75 112.62,41.25 117.75,36.12 127.12,36.12 128.75,37.75 129.38,37.75 IC27.28
N$2  (via drill 0.35)
  Top 0.152: v46.75,10.75 44.38,8.38 44.38,8 IC1.12 | v61.12,12.25 61.12,13.88 61.25,14 IC2.5
  Bottom 0.152: v46.75,10.75 59.62,10.75 v61.12,12.25
N$3  (via drill 0.35)
  Top 0.152: v47,9.75 45.75,8.5 45.75,8 IC1.13 | v62.38,12.25 62.38,13.75 62.62,14 IC2.4
  Bottom 0.152: v47,9.75 54.62,9.75 55.25,10.38 60.5,10.38 v62.38,12.25
N$4  (via drill 0.35)
  Top 0.152: v86.75,9.25 86.38,9.62 70.88,9.62 70.38,10.12 66.88,10.12 65.88,9.12 65.88,6.88 65.62,6.62 64.75,6.62 64.5,6.88 64.5,9.12 64.38,9.25 62.25,9.25 61.38,8.38 61.38,8 IC2.12 | v111.5,12.88 v106.88,12.88 | v116.88,12.75 116.88,13.25 120,16.38 122.38,16.38 v124.5,18.5 | v130.25,15.88 130.25,14.12 IC3.5
  Bottom 0.152: v86.75,9.25 88.5,9.25 91.12,11.88 105.88,11.88 v106.88,12.88 | v111.5,12.88 116.75,12.88 v116.88,12.75 | v124.5,18.5 127.62,18.5 v130.25,15.88
N$5  (via drill 0.35)
  Top 0.152: v56.38,8 56.38,7.38 57.12,6.62 61.75,6.62 62.62,7.5 62.62,7.88 IC2.13 | v98.62,14.88 v73.62,14.88 | v114.25,15.62 v100.38,15.62 | v118.5,13.62 120.88,13.62 v126.62,19.38 | v131.5,15.88 131.5,14.25 131.62,14.12 IC3.4
  Bottom 0.152: v56.38,8 68.75,8 70.5,9.75 70.5,11.75 v73.62,14.88 | v98.62,14.88 99.62,14.88 v100.38,15.62 | v114.25,15.62 115,15.62 117,13.62 v118.5,13.62 | v126.62,19.38 128,19.38 v131.5,15.88
N$6
  Top 0.152: IC3.12 130.38,7.88 130.38,7.5 131.25,6.62 132.12,6.62 132.25,6.75 132.25,9 133.88,10.62 152.88,10.62 155.25,13 155.25,15.25 155.12,15.38 154.25,15.38 153.38,14.5 153.38,14.12 IC4.5
N$7
  Top 0.152: IC3.13 131.75,8 131.75,9 133.75,11 152,11 154.62,13.62 154.62,14 IC4.4
N$18
  Bottom 0.152: IC27.1 141.25,41.75 148.5,41.75 150.5,39.75 152,39.75 152.88,38.88 SV5.3
N$19  (via drill 0.35)
  Top 0.152: v146.25,40.25 151.88,40.25 152.88,41.25 SV5.4
  Bottom 0.152: v146.25,40.25 141.25,40.25 IC27.3
N$20
  Bottom 0.152: IC27.2 141.25,41.12 146.62,41.12 150,37.75 153.25,37.75 154.5,39 154.5,40.38 155.38,41.25 SV5.6
N$21
  Bottom 0.152: IC27.4 141.12,39.5 140.5,39.5 140.12,39.88 140.12,42.12 140.38,42.38 149.38,42.38 150.38,41.38 SV5.2
N$24
  Bottom 0.152: U$1.PIN13 95,43 91.62,39.62 91.62,29.12 91.75,29 95.75,29 95.88,29.12 95.88,30.38 94.62,31.62 94.62,33.38 RN1.8
N$25
  Bottom 0.152: RN1.7 95.88,33.38 95.88,30.88 96.75,30 96.75,29.12 97.25,28.62 103.5,28.62 104.38,29.5 104.38,36.75 105.88,38.25 105.88,44.38 105.25,45 U$1.PIN9
N$26
  Bottom 0.152: RN1.6 97.12,33.38 97.12,32.75 100,29.88 U$1.PIN4
N$27
  Bottom 0.152: RN1.5 98.25,33.5 98.25,33.88 97.5,34.62 94.12,34.62 94,34.5 94,30.88 95,29.88 U$1.PIN2
N$28
  Bottom 0.152: RN1.4 99.62,33.5 99.62,33.75 98.38,35 94,35 92.5,33.5 92.5,29.88 U$1.PIN1
N$29
  Bottom 0.152: RN1.3 100.88,33.5 100.88,39 100.25,39.62 100.25,42.38 97.62,45 U$1.PIN12
N$30
  Bottom 0.152: RN1.2 102.25,33.38 102.25,30.12 102.5,29.88 U$1.PIN5
N$31
  Bottom 0.152: RN1.1 103.5,33.38 103.5,29.12 103.38,29 98.38,29 97.62,29.75 U$1.PIN3
SIGNAL0  (via drill 0.35)
  Top 0.152: v46.75,16.25 46.88,16.12 46.88,14.12 IC1.3 47,14 47,13.5 50.88,9.62 54.75,9.62 v55.5,8.88 | v143,35 143.62,34.38 143.62,28.62 v141.38,26.38 | v165.75,4.62 165.12,4.62 162.38,1.88 95.62,1.88 91.12,6.38 | 91.12,6.38 91.12,6.62 BOTTOMBUS.1 91.12,6.38 | v59.62,3.5 68.38,3.5 70.75,1.12 85.88,1.12 91.12,6.38
  Bottom 0.152: v46.75,16.25 46.75,20.38 43.5,23.62 43.5,25.12 32.75,35.88 27.88,35.88 27.75,36 27.75,36.88 28.5,37.62 29,37.62 IC12.11 | v143,35 142.62,35.38 141.25,35.38 IC27.9 | v141.38,26.38 141.38,22.88 152.5,11.75 158.62,11.75 v165.75,4.62 | v55.5,8.88 55.5,7.62 v59.62,3.5
SIGNAL1  (via drill 0.35)
  Top 0.152: v47.75,15.88 48.12,15.5 48.12,14.12 IC1.2 | v142.75,34 142.75,31.12 143.25,30.62 143.25,29.88 139,25.62 v132.62,25.62 | v95.38,22.5 96.12,23.25 96.12,24.12 95.62,24.62 74.88,24.62 v74.62,24.88 | v44.5,23.88 61.12,23.88 v61.25,24
  Bottom 0.152: v47.75,15.88 47.75,21.38 44.88,24.25 | 44.88,24.25 32.75,36.38 29.12,36.38 IC12.12 | v142.75,34 142.12,34.62 141.25,34.62 IC27.10 | v132.62,25.62 131.75,25.62 130.75,26.62 121.88,26.62 119.25,29.25 111.62,29.25 104.88,22.5 v95.38,22.5 | BOTTOMBUS.2 91,9.25 90,8.25 86.5,8.25 74.62,20.12 v74.62,24.88 72.12,24.88 66.88,30.12 62.38,30.12 61.25,29 v61.25,24 | v44.5,23.88 44.88,24.25
SIGNAL2  (via drill 0.35)
  Top 0.152: v139.62,33.75 138.88,33.75 137.25,32.12 132.5,32.12 121.88,21.5 111.62,21.5 104.62,28.5 75.5,28.5 74.25,29.75 66.5,29.75 | 66.5,29.75 55.75,29.75 54.75,28.75 51.5,28.75 45.88,34.38 v30.88,34.38 | v43,20.5 43,14.12 IC1.6 | 66.5,29.75 v66.5,29.25
  Bottom 0.152: v139.62,33.75 141.12,33.75 IC27.11 | IC12.13 29.12,35.12 29.5,35.12 30.25,34.38 v30.88,34.38 33.75,34.38 34.88,33.25 34.88,31.25 43,23.12 v43,20.5 | v66.5,29.25 66.5,26.25 80.75,12 80.75,9.62 84.62,5.75 91.5,5.75 92.38,6.62 93.62,6.62 BOTTOMBUS.3
SIGNAL3  (via drill 0.35)
  Top 0.152: v33.25,29.12 35.25,29.12 37,30.88 v41.38,30.88 45.75,30.88 50.62,26 v68,26 | v37.88,18.5 41.75,14.62 41.75,14.12 IC1.7
  Bottom 0.152: v41.38,30.88 42.88,32.38 72.75,32.38 87.25,46.88 135.5,46.88 137.5,44.88 153.25,44.88 156.5,41.62 156.5,38.38 154.88,36.75 146.75,36.75 142.12,32.12 139.5,32.12 IC27.12 | IC12.14 29.12,33.88 30.12,33.88 33.62,30.38 33.62,29.5 v33.25,29.12 33.62,28.75 33.62,20.25 35.38,18.5 v37.88,18.5 | v68,26 86.12,7.88 91.12,7.88 92.5,9.25 93.62,9.25 BOTTOMBUS.4
SIGNAL4  (via drill 0.35)
  Top 0.152: v138.5,30 138.5,28.75 v137.12,27.38 | v116.25,18 113.88,18 113.62,17.75 93.12,17.75 86.88,24 68.25,24 v67.88,23.62 | v64.75,12.25 64.75,12.75 64,13.5 64,14 IC2.3 | v34.88,30 v32.75,30 | v45.88,19.5 56,19.5 57.12,20.62 67.38,20.62 v67.88,20.12
  Bottom 0.152: v138.5,30 138.5,32 IC27.13 | v137.12,27.38 137.12,18.25 133.5,14.62 120.25,14.62 116.88,18 v116.25,18 | 67.88,15.75 67.88,11.62 68.12,11.38 68.12,10.62 67.62,10.12 66.88,10.12 v64.75,12.25 | 67.88,15.75 v67.88,20.12 v67.88,23.62 | v32.75,30 30.12,32.62 29.12,32.62 IC12.15 | v34.88,30 34.88,27.38 42.75,19.5 v45.88,19.5 | 67.88,15.75 74,15.75 74.5,15.25 74.5,14.88 85,4.38 94.38,4.38 96.12,6.12 96.12,6.62 BOTTOMBUS.5
SIGNAL5  (via drill 0.35)
  Top 0.152: IC2.2 65.25,14 65.25,13 v67.25,11 67.75,10.5 70.5,10.5 70.88,10.12 88.38,10.12 88.88,10.62 94.88,10.62 96.12,9.38 BOTTOMBUS.6 | v137.75,36.75 137.75,39.88 131.5,46.12 90.75,46.12 v87.5,42.88 | 54.38,33.25 47.5,33.25 46,34.75 31.75,34.75 31.25,35.25 28.38,35.25 v26.38,33.25 | 54.38,33.25 v77.88,33.25 | 54.38,33.25 v54.38,29.62
  Bottom 0.152: v137.75,36.75 137.75,32.12 IC27.14 | v77.88,33.25 v87.5,42.88 | v26.38,33.25 26.38,33 28,31.38 29,31.38 IC12.16 | v67.25,11 67.25,16.75 v54.38,29.62
SIGNAL6  (via drill 0.35)
  Top 0.152: v62,10.62 61.5,10.62 60.12,12 60.12,14 IC2.6 | v137.38,30.5 137.38,30.75 136.75,31.38 132.75,31.38 124.38,23 124.38,22.25 122.88,20.75 121.62,20.75 110.88,10 110.88,6.38 109.12,4.62 103.75,4.62 103.12,4 100.5,4 99.88,4.62 v99.12,4.62 | v68.75,9.25 85.5,9.25 86.38,8.38 87.12,8.38 89,10.25 94,10.25 95.25,9 95.25,8.88 96.38,7.75 97.62,7.75 98.62,6.75 BOTTOMBUS.7
  Bottom 0.152: IC12.17 29.12,30 29.75,30 33.25,26.5 33.25,19.88 44.62,8.5 50.62,8.5 53,6.12 53.75,6.12 54.25,6.62 54.25,8.88 55.12,9.75 55.88,9.75 56.25,9.38 60,9.38 61.25,10.62 v62,10.62 65.88,10.62 67.25,9.25 v68.75,9.25 | v137.38,30.5 137.38,30.75 137,31.12 137,32 IC27.15 | v99.12,4.62 99.12,6.25 98.75,6.62 BOTTOMBUS.7
SIGNAL7  (via drill 0.35)
  Top 0.152: v136.38,30.5 132.38,30.5 124.75,22.88 124.75,22.12 123,20.38 121.75,20.38 111.25,9.88 111.25,6.25 109,4 105,4 v104.75,3.75 | 59.5,15.25 59.62,15.38 65.62,15.38 65.88,15.12 65.88,12.88 66.88,11.88 69.62,11.88 71,10.5 88.25,10.5 88.75,11 95,11 95.75,10.25 97.75,10.25 BOTTOMBUS.8 | 59.5,15.25 58.88,14.62 58.88,14.12 IC2.7 | v30.88,27.62 44.38,27.62 v45,28.25 | 59.5,15.25 v58.25,16.5
  Bottom 0.152: v136.38,30.5 136.25,30.62 136.25,32 IC27.16 | v104.75,3.75 104.75,4.38 102.25,6.88 102.25,7.12 101.12,8.25 99.75,8.25 BOTTOMBUS.8 | v30.88,27.62 29.75,28.75 29.12,28.75 IC12.18 | v45,28.25 45.88,28.25 55.88,18.25 56.5,18.25 v58.25,16.5
SIGNAL8  (via drill 0.35)
  Top 0.152: v133.5,15.88 133.5,14.62 133,14.12 IC3.3 | v30.88,19.75 32.38,19.75 34.38,21.75 67.75,21.75 68.75,22.75 v80.75,22.75 | v90,13.5 96.25,13.5 98.88,10.88 101,10.88 102.25,9.62 102.25,7.75 | 102.25,7.75 102.25,7.62 101.38,6.75 BOTTOMBUS.9 | v133.25,33.62 131,33.62 121.75,24.38 v121.75,24 | v118.12,19 118.12,18.25 109.88,10 109.88,8.88 108.75,7.75 108.5,7.75 107.38,6.62 107.38,6.38 106.75,5.75 106,5.75 104.75,7 104.75,7.12 104.12,7.75 102.25,7.75
  Bottom 0.152: v133.5,15.88 134.88,17.25 134.88,28.62 133.88,29.62 133.88,32 IC27.19 133.75,32.12 133.75,33.12 v133.25,33.62 | v30.88,19.75 29.12,19.75 IC7.11 | v90,13.5 v80.75,22.75 | v121.75,24 120.5,24 118.12,21.62 v118.12,19
SIGNAL9  (via drill 0.35)
  Top 0.152: v134,17.62 134,16.62 134.38,16.25 134.38,14.25 134.25,14.12 IC3.2 | v49.25,3.62 v41.75,3.62 | v110.38,31 v112.88,31 | v93.25,18.88 v98.5,24.12 | v92.88,15.88 73.38,15.88 72.75,15.25 72.75,14.5 73.25,14 v74.12,14
  Bottom 0.152: v134,17.62 134.38,18 134.38,28.62 133,30 133,32 IC27.20 132.88,32.12 132.88,32.75 132.5,33.12 124.38,33.12 122.25,31 v112.88,31 | v41.75,3.62 33.88,11.5 27.88,11.5 27.38,12 27.38,17.75 28,18.38 29,18.38 IC7.12 | v49.25,3.62 57.75,3.62 59.12,2.25 69.62,2.25 71.38,4 74.88,4 | 74.88,4 94.88,4 97.75,6.88 97.75,9.62 98.38,10.25 100.38,10.25 101.25,9.38 BOTTOMBUS.10 | v110.38,31 103.5,24.12 v98.5,24.12 | v93.25,18.88 91.5,17.12 91.5,16.38 92,15.88 v92.88,15.88 | v74.12,14 74.12,11 71.88,8.75 71.88,8 72.38,7.5 73.12,7.5 73.62,8 74.38,8 74.88,7.5 74.88,4
SIGNAL10  (via drill 0.35)
  Top 0.152: v133.5,28.25 133.5,28.62 132.88,29.25 132.12,29.25 125.5,22.62 125.5,21.88 123.25,19.62 122,19.62 121.12,18.75 | 121.12,18.75 112,9.62 112,6 110.25,4.25 v110.25,3.5 | v47.88,2 49.75,2 50.75,3 50.75,5.62 53,7.88 53.75,7.88 56.38,5.25 65.88,5.25 67,6.38 70.75,6.38 v72.75,8.38 | v76.12,11.75 76.62,11.25 80.5,11.25 81.5,12.25 84.12,12.25 85.88,14 86.62,14 87.62,13 87.62,12.38 88.62,11.38 95.12,11.38 95.62,10.88 97.62,10.88 98,10.5 99.88,10.5 100,10.38 100,5.5 100.75,4.75 102.88,4.75 103.75,5.62 103.75,6.62 BOTTOMBUS.11 | v129,15.88 129.12,15.75 129.12,14.12 IC3.6 | 121.12,18.75 v121.75,18.12
  Bottom 0.152: v133.5,28.25 133.5,28.62 132.88,29.25 132.88,29.5 132.12,30.25 132.12,32 IC27.21 | v110.25,3.5 109.75,4 105.75,4 104.38,5.38 104.38,6.12 103.88,6.62 BOTTOMBUS.11 | v47.88,2 47.38,2.5 47.38,3.25 42.88,7.75 42.38,7.75 40.25,9.88 36,9.88 35.5,10.38 35.5,13 31.38,17.12 29.12,17.12 IC7.13 | v76.12,11.75 v72.75,8.38 | v129,15.88 128.12,15 127.12,15 125.75,16.38 125.75,16.88 125,17.62 122.25,17.62 v121.75,18.12
SIGNAL11  (via drill 0.35)
  Top 0.152: v132.38,28.25 131.62,28.25 127.5,24.12 127.5,17.25 124.62,14.38 124.62,12.5 | 124.62,12.5 125.12,12 126.25,12 127.75,13.5 127.75,14 IC3.7 | v31,16.25 31,17.12 v34.5,20.62 | v34,32.88 46.38,32.88 51.25,28 69.25,28 70.25,29 73.25,29 75.5,26.75 v80.62,26.75 | v97.12,13.88 99.75,11.25 101.88,11.25 103.75,9.38 BOTTOMBUS.12 | 124.62,12.5 122.5,12.5 121.88,11.88 v116,11.88 | v107.88,11.88 v109.75,11.88
  Bottom 0.152: v132.38,28.25 131.5,29.12 131.5,32 IC27.22 | v31,16.25 30.5,16.25 30.25,16 29.12,16 IC7.14 | v34.5,20.62 34.5,29.12 34,29.62 v34,32.88 | v80.62,26.75 93.5,13.88 v97.12,13.88 | v109.75,11.88 v116,11.88 | v107.88,11.88 106.38,11.88 103.88,9.38 BOTTOMBUS.12
SIGNAL12  (via drill 0.35)
  Top 0.152: v117.25,27.25 v121.88,31.88 | BOTTOMBUS.13 106.38,6.75 107.38,7.75 107.38,11.12 104.75,13.75 v104.75,14.75 100,14.75 99,15.75 94.62,15.75 86.75,23.62 69.12,23.62 67.62,22.12 32,22.12 30,20.12 30,16 v30.75,15.25 | v141.25,9.75 141.5,10 152.75,10 155.88,13.12 155.88,14 IC4.3 | v127.88,10.5 124.88,10.5 124.38,11 124.12,11 123.62,11.5 122.5,11.5 117.5,6.5 v113.25,6.5
  Bottom 0.152: v121.88,31.88 123.75,33.75 129.5,33.75 IC27.23 | v104.75,14.75 v117.25,27.25 | v30.75,15.25 30.25,14.75 29.12,14.75 IC7.15 | v141.25,9.75 131.75,9.75 131.25,9.25 129.12,9.25 v127.88,10.5 | v113.25,6.5 110,6.5 109.25,5.75 107.25,5.75 106.38,6.62 BOTTOMBUS.13
SIGNAL13  (via drill 0.35)
  Top 0.152: v104.75,24.12 102.88,24.12 v97.38,18.62 | v98.38,13.88 101.75,13.88 106.25,9.38 BOTTOMBUS.14 | v37.62,20.88 v32,15.25 | v37.62,23.38 40,23.38 42.25,25.62 67.12,25.62 67.62,25.12 71.38,25.12 v72.25,26 | v156.5,10.12 156.5,10.38 157.12,11 157.12,14 IC4.2
  Bottom 0.152: v104.75,24.12 112.5,31.88 115.88,31.88 118.12,34.12 127.25,34.12 127.75,34.62 129.5,34.62 IC27.24 | 97.38,18.5 97.38,14.88 v98.38,13.88 | v32,15.25 30.12,13.38 29.12,13.38 IC7.16 | v37.62,23.38 v37.62,20.88 | v72.25,26 75.12,28.88 87,28.88 97.38,18.5 | 97.38,18.5 v97.38,18.62 | v156.5,10.12 155.75,10.12 151.25,5.62 142.62,5.62 142.38,5.38 128.88,5.38 127.75,6.5 115,6.5 113.25,4.75 107,4.75 105.38,6.38 105.38,8.38 106.25,9.25 BOTTOMBUS.14
SIGNAL14  (via drill 0.35)
  Top 0.152: 120.88,24.38 v131.12,34.62 | v120.88,23.12 120.88,24.38 | v120.88,17.25 120.12,17.25 112.38,9.5 112.38,6 v112.75,5.62 | v32.38,23.38 36.38,23.38 39.5,26.5 v48.88,26.5 | v90.75,32.38 104.12,32.38 106.88,29.62 106.88,29.12 111.62,24.38 120.88,24.38 | v144.12,6.88 144.12,7.75 146,9.62 153.25,9.62 156.5,12.88 156.5,15.25 156,15.75 153.25,15.75 152.12,14.62 152.12,14.12 IC4.6
  Bottom 0.152: v131.12,34.62 130.38,35.38 129.62,35.38 IC27.25 | v120.88,17.25 v120.88,23.12 | v112.75,5.62 113.62,5.62 114.12,6.12 114.12,6.88 | 114.12,6.88 113.62,7.38 109.62,7.38 109,6.75 BOTTOMBUS.15 | v32.38,23.38 32.38,20 30.25,17.88 28,17.88 27.75,17.62 27.75,12.88 28.5,12.12 29,12.12 IC7.17 | v48.88,26.5 54.38,32 72.88,32 85.38,44.5 87.12,44.5 90.75,40.88 v90.75,32.38 | v144.12,6.88 143.38,6.88 142.25,5.75 129,5.75 127.88,6.88 114.12,6.88
SIGNAL15  (via drill 0.35)
  Top 0.152: v126.88,35 126.88,32.12 v120,25.25 | v25.38,32.88 25.88,32.38 32.25,32.38 33.62,33.75 46,33.75 51.38,28.38 69.12,28.38 70.12,29.38 74.12,29.38 v75.88,27.62 | v115.12,11 121.5,11 122.38,11.88 123.75,11.88 124,11.62 148.88,11.62 150.75,13.5 150.75,14 IC4.7
  Bottom 0.152: v126.88,35 128,36.12 129.5,36.12 IC27.26 | v120,25.25 115.12,20.38 112.75,20.38 108.88,16.5 108.88,13.75 | 108.88,11 108.88,9.38 BOTTOMBUS.16 | 108.88,11 108.88,13.75 | v25.38,32.88 27.25,31 27.25,29 26.62,28.38 26.62,10.25 28,8.88 30.12,8.88 30.38,9.12 30.38,10 29.62,10.75 29.12,10.75 IC7.18 | v75.88,27.62 75.88,19.38 83,12.25 105,12.25 106.5,13.75 108.88,13.75 | 108.88,11 v115.12,11
VCC  (via drill 0.35)
  Top 0.457: 159.38,4.62 164.38,4.62 165.38,5.62 166.12,5.62 169,2.75 181.38,2.75 182,3.38 182,3.5 182.5,4 C3.1 182.38,4.12 182.38,34.88 181.38,35.88 181.38,38.12 181.62,38.38 185.38,38.38 | 159.38,4.62 158.5,5.5 158.5,7.88 IC4.16 | 159.38,4.62 157.5,2.75 146.25,2.75 141.12,7.88 135.5,7.88 IC3.16 | 185.38,38.38 185.38,42.12 183,44.5 J1.2 182.88,44.38 182.62,44.38 180.88,42.62 176.5,42.62 173.25,45.88 162.62,45.88 155.62,38.88 SV5.5 155.38,38.75 v152.5,35.88 | 185.38,38.38 185.38,37 C4.1 | 134.62,34.62 v132.25,34.62 132.12,34.75 132.12,35 131.12,36 120.12,36 117.25,33.12 107.62,33.12 105.75,35 88.38,35 85.5,37.88 28.62,37.88 27.25,36.5 23.88,36.5 v21.5,34.12 11.62,44 C1.1 | v135.62,33.62 134.62,34.62 | 134.62,34.62 v134.62,41.25 | v21.88,28.75 23.25,28.75 v28,24 v25.75,21.75 | 50.25,8 52.38,8 52.75,8.38 54,8.38 56.62,5.75 65.5,5.75 66.38,6.62 66.38,7.88 IC2.16 | 50.25,8 49.5,8 IC1.16 | v11,5.88 9.62,4.5 9.62,4 C2.1 9.75,3.88 11.38,2.25 41.75,2.25 42.5,3 48.25,3 48.62,2.62 49.62,2.62 50.25,3.25 50.25,8
  Bottom 0.457: v152.5,35.88 146.62,35.88 139.75,29 136.5,29 135.38,30.12 135.38,32 IC27.17 135.38,32.25 135.38,32.88 135.62,33.12 v135.62,33.62 | v132.25,34.62 132.25,35.12 130.38,37 129.62,37 IC27.27 | IC27.5 141.25,38.62 148.38,38.62 149.75,37.25 153.88,37.25 155.38,38.75 SV5.5 | v134.62,41.25 134.62,43.62 IC27.38 | v21.5,34.12 21.5,30.38 21.25,30.12 21.25,29.38 v21.88,28.75 | v28,24 28,25.25 29,26.25 IC12.20 | v11,5.88 27.12,5.88 28.62,7.38 | 28.62,7.38 29,7.75 29,8.25 IC7.20 | v25.75,21.75 25.75,10.25 28.62,7.38

### Text on the board
bPlace: BRD1001-001-001-320 A Counting Registers | Copyright 2020 James Wright